# Altium schematic sheet DP83848Ethernet.SchDoc
size A4; Revision: B.2(PCB.SCH)
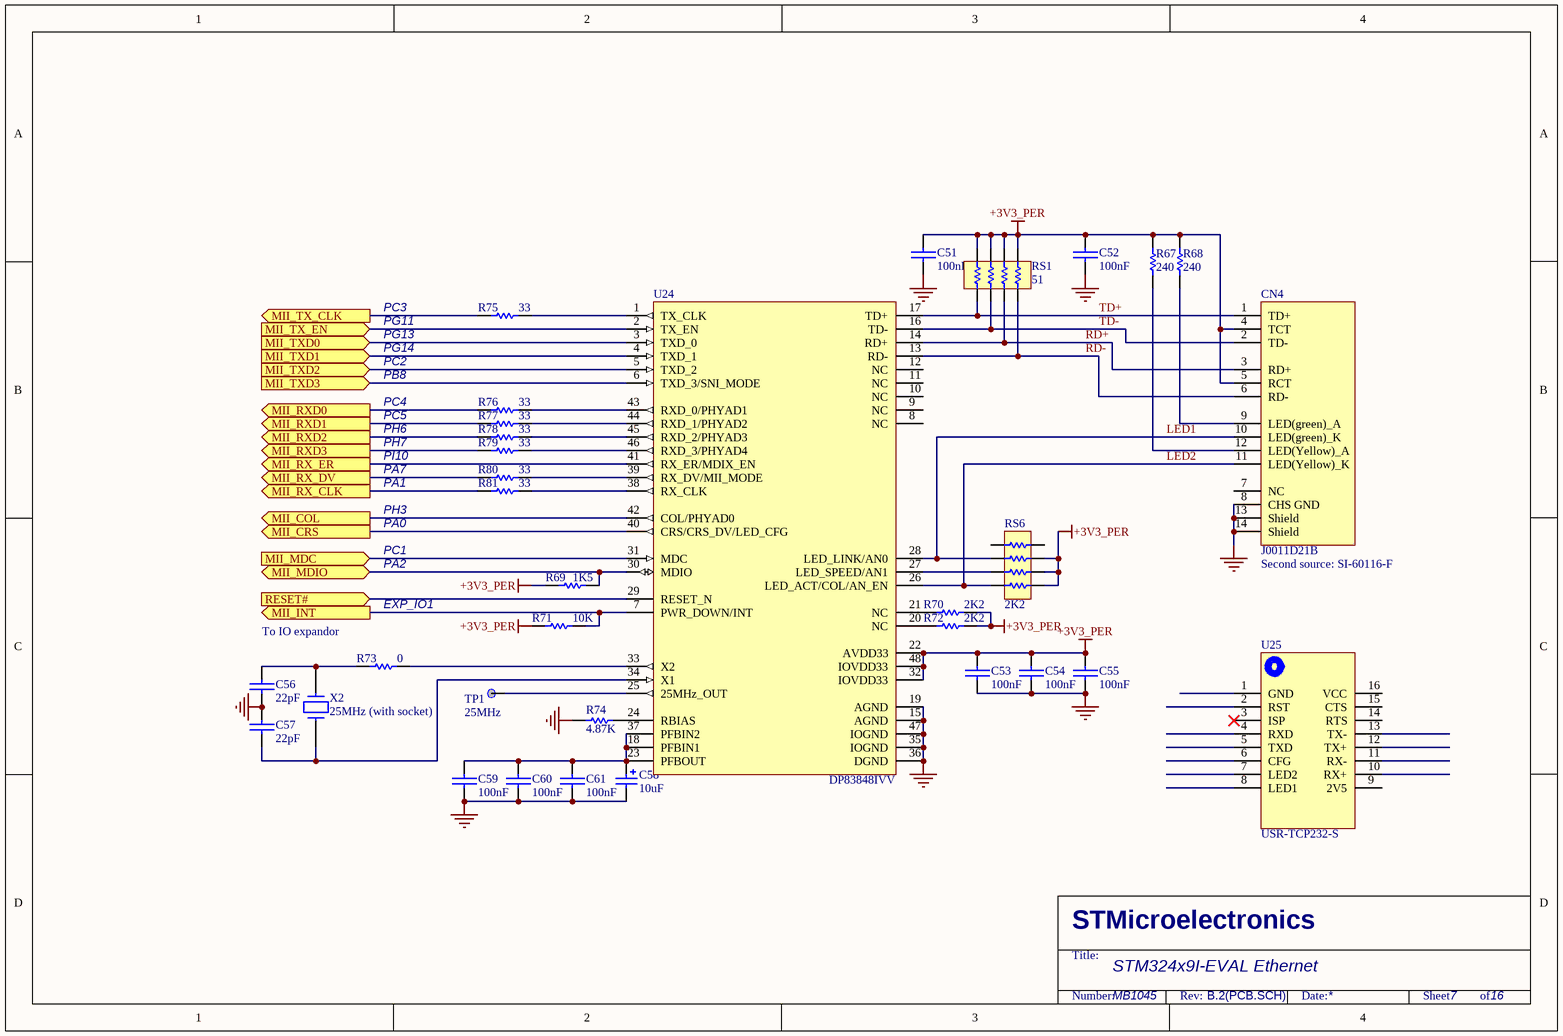
[diagram p0: DP83848Ethernet.SchDoc]

## Parts
C51  100nF  [CAP_0603]
C52  100nF  [CAP_0603]
C53  100nF  [CAP_0603]
C54  100nF  [CAP_0603]
C55  100nF  [CAP_0603]
C56  22pF  [CAP_0603]
C57  22pF  [CAP_0603]
C58  10uF  [CAP_TAN_A1206]
C59  100nF  [CAP_0603]
C60  100nF  [CAP_0603]
C61  100nF  [CAP_0603]
CN4  J0011D21B  [RJ45]
R67  240  [RES_0603]
R68  240  [RES_0603]
R69  1K5  [RES_0603]
R70  2K2  [RES_0603]
R71  10K  [RES_0603]
R72  2K2  [RES_0603]
R73  0  [RES_0603]
R74  4.87K  [RES_0603]
R75  33  [RES_0603]
R76  33  [RES_0603]
R77  33  [RES_0603]
R78  33  [RES_0603]
R79  33  [RES_0603]
R80  33  [RES_0603]
R81  33  [RES_0603]
RS1  51  [LC-0603_Rx4]
RS6  2K2  [LC-0603_Rx4]
TP1  25MHz  [TP]
U24  DP83848IVV  [LC-LQFP-48_7x7x05P]
U25  USR-TCP232-S  [USR-TCP232-S]
X2  25MHz (with socket)  [OSC-YSX-3225_4P]

## Ports
MII_COL (out), MII_CRS (out), MII_INT (out), MII_MDC (in), MII_MDIO (bidir), MII_RX_CLK (out), MII_RX_DV (out), MII_RX_ER (out), MII_RXD0 (out), MII_RXD1 (out), MII_RXD2 (out), MII_RXD3 (out), MII_TX_CLK (out), MII_TX_EN (in), MII_TXD0 (in), MII_TXD1 (in), MII_TXD2 (in), MII_TXD3 (in), RESET# (in)

## Nets
+3V3_PER: C51.2 C52.2 C53.1 C54.2 C55.2 CN4.4(TCT) CN4.5(RCT) R67.2 R68.2 R69.2 R70.2 R71.1 R72.2 RS1.2 RS1.4 RS1.6 RS1.8 RS6.1 RS6.3 RS6.5 U24.22(AVDD33) U24.32(IOVDD33) U24.48(IOVDD33)
GND: C51.1 C52.1 C53.2 C54.1 C55.1 C56.1 C57.2 C58.2 C59.2 C60.1 C61.1 CN4.8(CHS_GND) CN4.13(Shield) CN4.14(Shield) R74.1 U24.15(AGND) U24.19(AGND) U24.35(IOGND) U24.36(DGND) U24.47(IOGND)
LED1: CN4.10(LED(green)_K) RS6.6 U24.28(LED_LINK/AN0)
LED2: CN4.11(LED(Yellow)_K) RS6.2 U24.26(LED_ACT/COL/AN_EN)
MII_COL: U24.42(COL/PHYAD0) ; port MII_COL
MII_CRS: U24.40(CRS/CRS_DV/LED_CFG) ; port MII_CRS
MII_INT: R71.2 U24.7(PWR_DOWN/INT) ; port MII_INT
MII_MDC: U24.31(MDC) ; port MII_MDC
MII_MDIO: R69.1 U24.30(MDIO) ; port MII_MDIO
MII_RX_CLK: R81.2 ; port MII_RX_CLK
MII_RX_DV: R80.2 ; port MII_RX_DV
MII_RX_ER: U24.41(RX_ER/MDIX_EN) ; port MII_RX_ER
MII_RXD0: R76.2 ; port MII_RXD0
MII_RXD1: R77.2 ; port MII_RXD1
MII_RXD2: R78.2 ; port MII_RXD2
MII_RXD3: R79.2 ; port MII_RXD3
MII_TX_CLK: R75.2 ; port MII_TX_CLK
MII_TX_EN: U24.2(TX_EN) ; port MII_TX_EN
MII_TXD0: U24.3(TXD_0) ; port MII_TXD0
MII_TXD1: U24.4(TXD_1) ; port MII_TXD1
MII_TXD2: U24.5(TXD_2) ; port MII_TXD2
MII_TXD3: U24.6(TXD_3/SNI_MODE) ; port MII_TXD3
RD+: CN4.3(RD+) RS1.5 U24.14(RD+)
RD-: CN4.6(RD-) RS1.7 U24.13(RD-)
RESET#: U24.29(RESET_N) ; port RESET#
TD+: CN4.1(TD+) RS1.1 U24.17(TD+)
TD-: CN4.2(TD-) RS1.3 U24.16(TD-)
NetC56_2: C56.2 R73.2 X2.2
NetC57_1: C57.1 U24.34(X1) X2.1
NetC58_1: C58.1 C59.1 C60.2 C61.2 U24.18(PFBIN1) U24.23(PFBOUT) U24.37(PFBIN2)
NetCN4_9: CN4.9(LED(green)_A) R68.1
NetCN4_12: CN4.12(LED(Yellow)_A) R67.1
NetR70_1: R70.1 U24.21(NC)
NetR72_1: R72.1 U24.20(NC)
NetR73_1: R73.1 U24.33(X2)
NetR74_2: R74.2 U24.24(RBIAS)
NetR75_1: R75.1 U24.1(TX_CLK)
NetR76_1: R76.1 U24.43(RXD_0/PHYAD1)
NetR77_1: R77.1 U24.44(RXD_1/PHYAD2)
NetR78_1: R78.1 U24.45(RXD_2/PHYAD3)
NetR79_1: R79.1 U24.46(RXD_3/PHYAD4)
NetR80_1: R80.1 U24.39(RX_DV/MII_MODE)
NetR81_1: R81.1 U24.38(RX_CLK)
NetRS6_4: RS6.4 U24.27(LED_SPEED/AN1)
NetTP1_1: TP1.1 U24.25(25MHz_OUT)

Not connected (* = marked no-connect by the designer): CN4 7(NC); RS6 7 8; U24 8(NC) 9(NC) 10(NC) 11(NC) 12(NC); U25 1(GND) 2(RST) 3(ISP)* 4(RXD) 5(TXD) 6(CFG) 7(LED2) 8(LED1) 9(2V5) 10(RX+) 11(RX-) 12(TX+) 13(TX-) 14(RTS) 15(CTS) 16(VCC)

## Notes on the sheet
- PC3
- PG11
- PG13
- PG14
- PC2
- PB8
- PC4
- PC5
- PH6
- PH7
- PI10
- PA7
- PH3
- PA1
- PA0
- PC1
- PA2
- (near CN4) Second source: SI-60116-F
- To IO expandor
- EXP_IO1
- STM324x9I-EVAL Ethernet
- MB1045
- 7
- 16
- STMicroelectronics
- Title:
- Number:
- Rev:
- Date:
- Sheet          of

## Library data of the parts
C51-C57 C59-C61 = CAP: Capacitor
C58 = Cap Pol1: Polarized Capacitor (Radial); Published: 8-Jun-2000; Revision: July-2002: Re-released for DXP Platform.; Publisher: Altium Limited; Value: 10uF
R67-R81 = Res1: Resistor; Value: 1K; Published: 8-Jun-2000; Revision: July-2002: Re-released for DXP Platform.; Publisher: Altium Limited
RS1 RS6 = Resister Array
TP1 = TP
U24 = DP83848CVV
X2 = CRYSTAL